# Altium schematic sheet 06 - Voltage Sense.SchDoc: Voltage Sense - 25kW WolfPACK FM3 Six-Pack Inv.
size 431 x 279 mm; Date: 01/2024; DocumentNumber: CRD25DA12N-FMC; Revision: 1.2; SheetNumber: 6; SheetTotal: 8; SheetSize: B
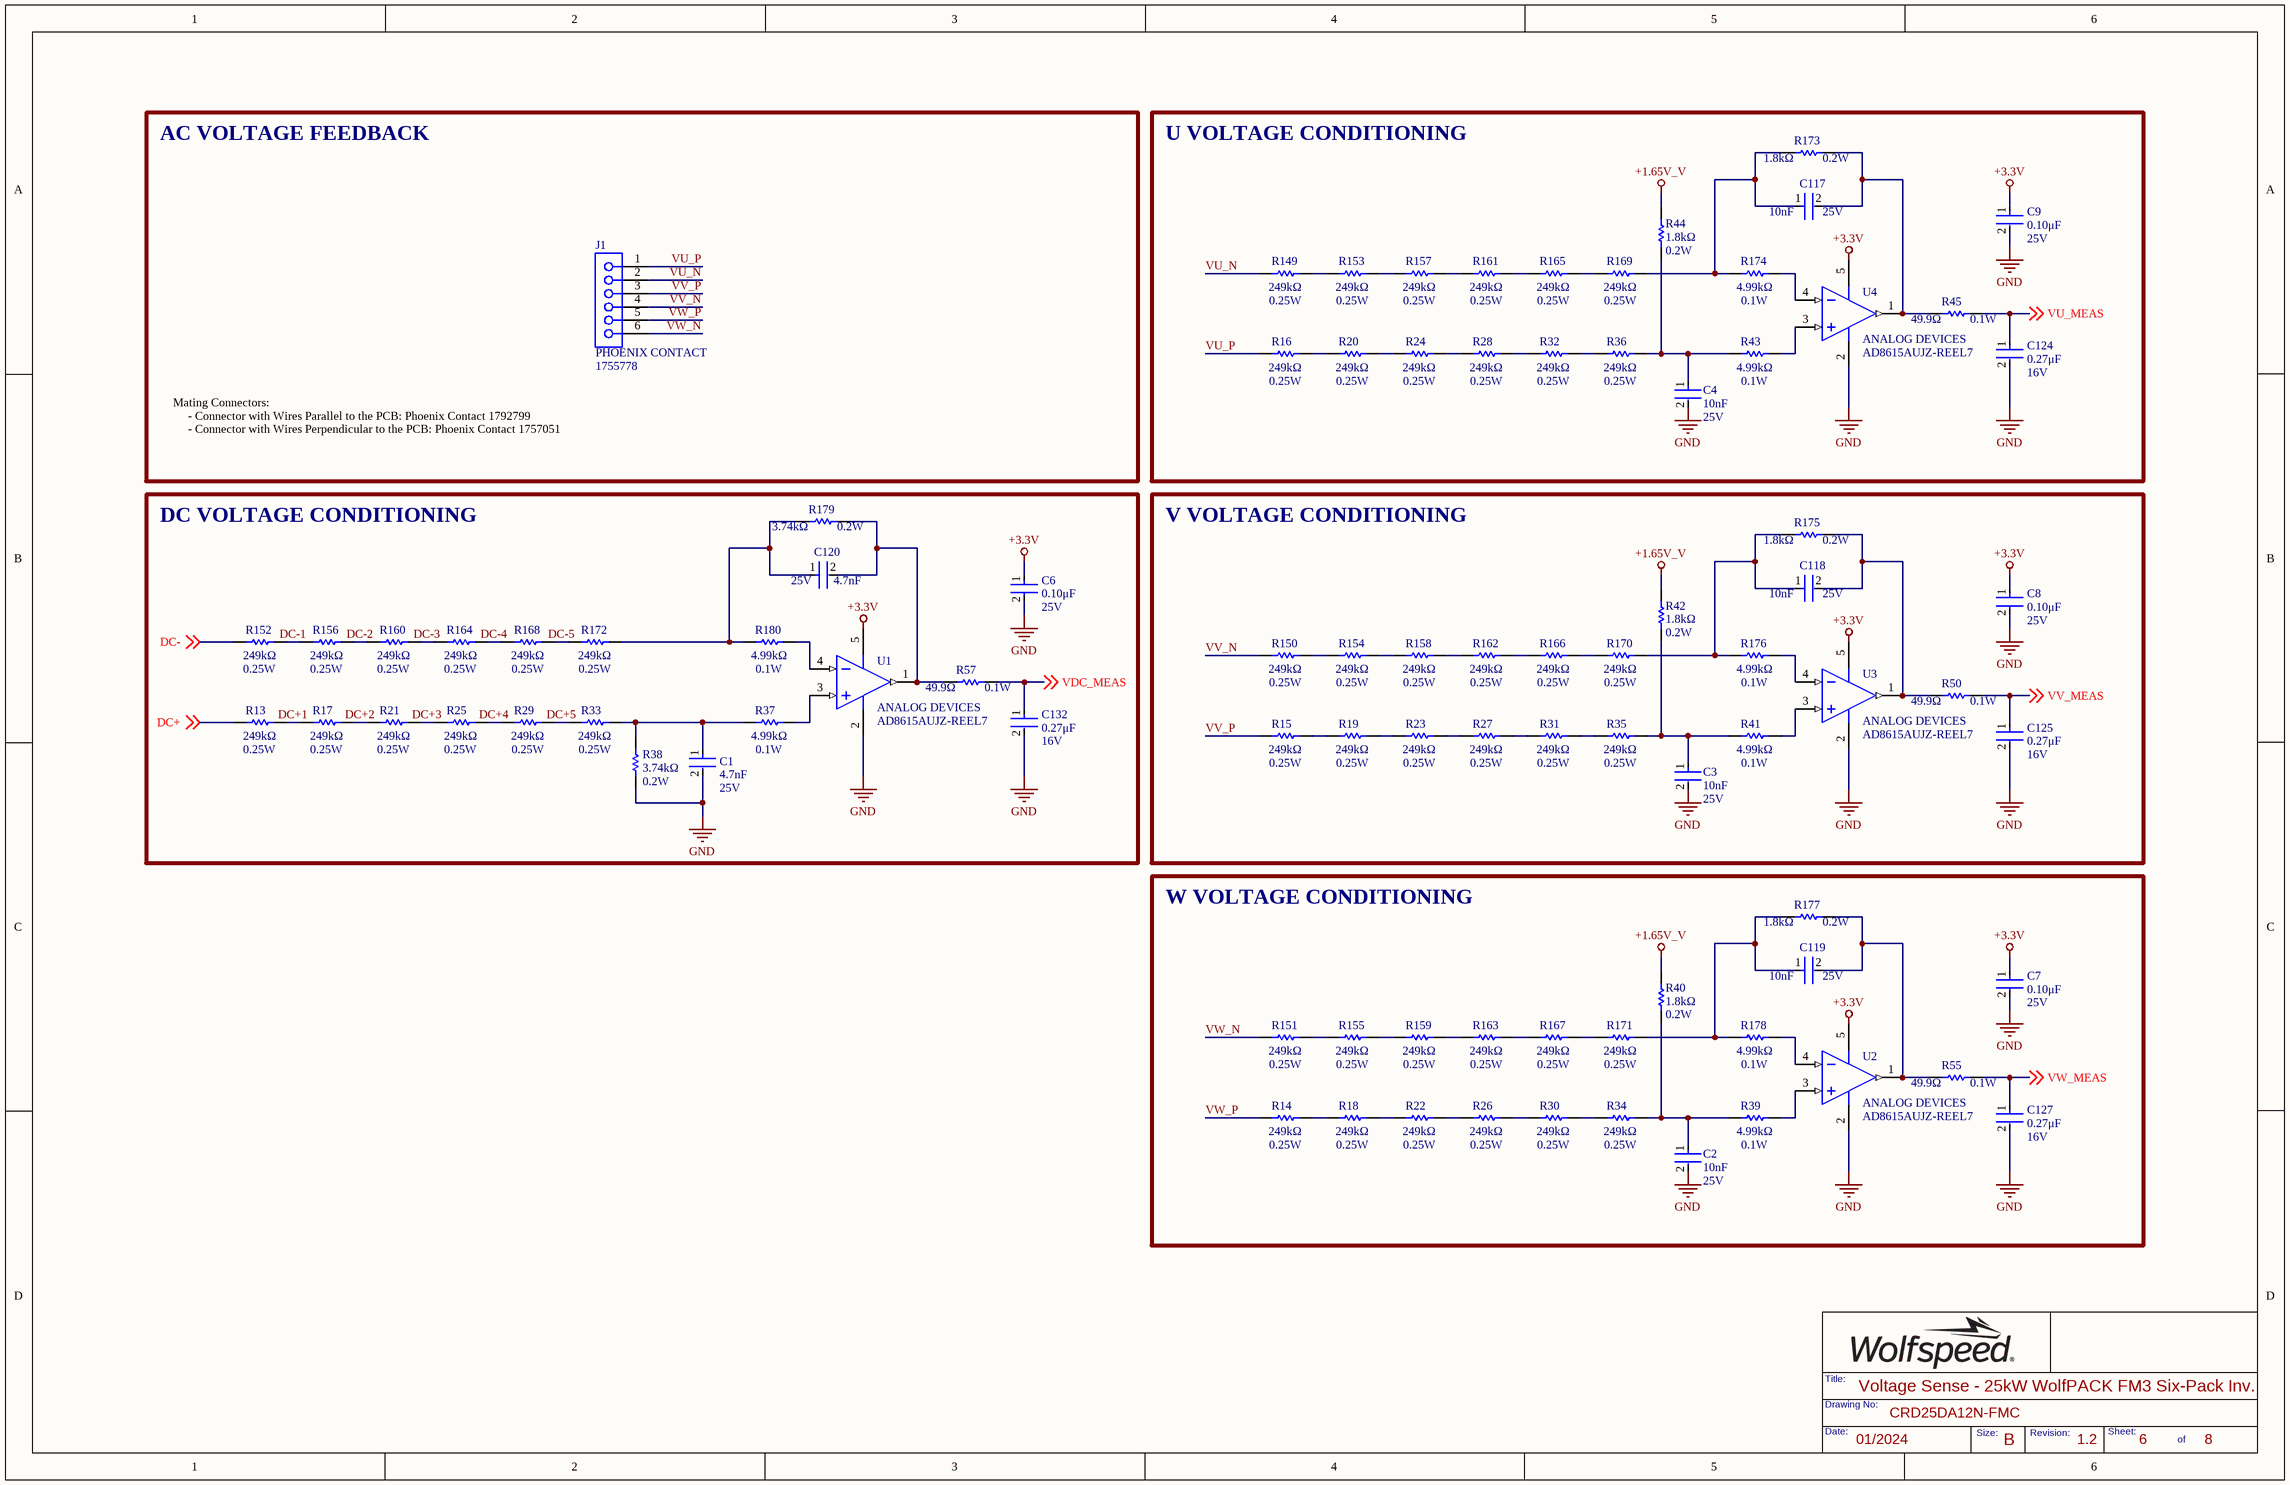
[diagram p0: 06 - Voltage Sense.SchDoc]

## Parts
C1  Voltage Rating: 25V  Capacitance: 4.7nF  [FP-C0603C-CF-IPC_B]  (hidden comment: C0603C472K3RAC7867)
C2  value 10nF  Voltage Rating: 25V  [FP-C0603C-CF-IPC_B]  (hidden comment: CL10B103KA8WPNC)
C3  value 10nF  Voltage Rating: 25V  [FP-C0603C-CF-IPC_B]  (hidden comment: CL10B103KA8WPNC)
C4  value 10nF  Voltage Rating: 25V  [FP-C0603C-CF-IPC_B]  (hidden comment: CL10B103KA8WPNC)
C6  Voltage Rating: 25V  Capacitance: 0.10μF  [FP-C0603C-CF-IPC_B]  (hidden comment: C0603C104K3RACTU)
C7  Voltage Rating: 25V  Capacitance: 0.10μF  [FP-C0603C-CF-IPC_B]  (hidden comment: C0603C104K3RACTU)
C8  Voltage Rating: 25V  Capacitance: 0.10μF  [FP-C0603C-CF-IPC_B]  (hidden comment: C0603C104K3RACTU)
C9  Voltage Rating: 25V  Capacitance: 0.10μF  [FP-C0603C-CF-IPC_B]  (hidden comment: C0603C104K3RACTU)
C117  value 10nF  Voltage Rating: 25V  [FP-C0603C-CF-IPC_B]  (hidden comment: CL10B103KA8WPNC)
C118  value 10nF  Voltage Rating: 25V  [FP-C0603C-CF-IPC_B]  (hidden comment: CL10B103KA8WPNC)
C119  value 10nF  Voltage Rating: 25V  [FP-C0603C-CF-IPC_B]  (hidden comment: CL10B103KA8WPNC)
C120  Voltage Rating: 25V  Capacitance: 4.7nF  [FP-C0603C-CF-IPC_B]  (hidden comment: C0603C472K3RAC7867)
C124  Voltage Rating (DC): 16V  Capacitance: 0.27μF  [FP-GCM188-0_1-IPC_A]  (hidden comment: GCM188R71C274KA37D)
C125  Voltage Rating (DC): 16V  Capacitance: 0.27μF  [FP-GCM188-0_1-IPC_A]  (hidden comment: GCM188R71C274KA37D)
C127  Voltage Rating (DC): 16V  Capacitance: 0.27μF  [FP-GCM188-0_1-IPC_A]  (hidden comment: GCM188R71C274KA37D)
C132  Voltage Rating (DC): 16V  Capacitance: 0.27μF  [FP-GCM188-0_1-IPC_A]  (hidden comment: GCM188R71C274KA37D)
J1  1755778  Manufacturer Print: PHOENIX CONTACT  [1755778]
R13  Resistance: 249kΩ  Power: 0.25W  [RESC3216X65X50NL15T25]  (hidden comment: TNPW1206249KBEEA)
R14  Resistance: 249kΩ  Power: 0.25W  [RESC3216X65X50NL15T25]  (hidden comment: TNPW1206249KBEEA)
R15  Resistance: 249kΩ  Power: 0.25W  [RESC3216X65X50NL15T25]  (hidden comment: TNPW1206249KBEEA)
R16  Resistance: 249kΩ  Power: 0.25W  [RESC3216X65X50NL15T25]  (hidden comment: TNPW1206249KBEEA)
R17  Resistance: 249kΩ  Power: 0.25W  [RESC3216X65X50NL15T25]  (hidden comment: TNPW1206249KBEEA)
R18  Resistance: 249kΩ  Power: 0.25W  [RESC3216X65X50NL15T25]  (hidden comment: TNPW1206249KBEEA)
R19  Resistance: 249kΩ  Power: 0.25W  [RESC3216X65X50NL15T25]  (hidden comment: TNPW1206249KBEEA)
R20  Resistance: 249kΩ  Power: 0.25W  [RESC3216X65X50NL15T25]  (hidden comment: TNPW1206249KBEEA)
R21  Resistance: 249kΩ  Power: 0.25W  [RESC3216X65X50NL15T25]  (hidden comment: TNPW1206249KBEEA)
R22  Resistance: 249kΩ  Power: 0.25W  [RESC3216X65X50NL15T25]  (hidden comment: TNPW1206249KBEEA)
R23  Resistance: 249kΩ  Power: 0.25W  [RESC3216X65X50NL15T25]  (hidden comment: TNPW1206249KBEEA)
R24  Resistance: 249kΩ  Power: 0.25W  [RESC3216X65X50NL15T25]  (hidden comment: TNPW1206249KBEEA)
R25  Resistance: 249kΩ  Power: 0.25W  [RESC3216X65X50NL15T25]  (hidden comment: TNPW1206249KBEEA)
R26  Resistance: 249kΩ  Power: 0.25W  [RESC3216X65X50NL15T25]  (hidden comment: TNPW1206249KBEEA)
R27  Resistance: 249kΩ  Power: 0.25W  [RESC3216X65X50NL15T25]  (hidden comment: TNPW1206249KBEEA)
R28  Resistance: 249kΩ  Power: 0.25W  [RESC3216X65X50NL15T25]  (hidden comment: TNPW1206249KBEEA)
R29  Resistance: 249kΩ  Power: 0.25W  [RESC3216X65X50NL15T25]  (hidden comment: TNPW1206249KBEEA)
R30  Resistance: 249kΩ  Power: 0.25W  [RESC3216X65X50NL15T25]  (hidden comment: TNPW1206249KBEEA)
R31  Resistance: 249kΩ  Power: 0.25W  [RESC3216X65X50NL15T25]  (hidden comment: TNPW1206249KBEEA)
R32  Resistance: 249kΩ  Power: 0.25W  [RESC3216X65X50NL15T25]  (hidden comment: TNPW1206249KBEEA)
R33  Resistance: 249kΩ  Power: 0.25W  [RESC3216X65X50NL15T25]  (hidden comment: TNPW1206249KBEEA)
R34  Resistance: 249kΩ  Power: 0.25W  [RESC3216X65X50NL15T25]  (hidden comment: TNPW1206249KBEEA)
R35  Resistance: 249kΩ  Power: 0.25W  [RESC3216X65X50NL15T25]  (hidden comment: TNPW1206249KBEEA)
R36  Resistance: 249kΩ  Power: 0.25W  [RESC3216X65X50NL15T25]  (hidden comment: TNPW1206249KBEEA)
R37  Power Rating: 0.1W  Resistance: 4.99kΩ  [FP-MCR03-IPC_B]  (hidden comment: RC0603FR-074K99L)
R38  Max Power Dissipation: 0.2W  Resistance: 3.74kΩ  [FP-MCR03-IPC_B]  (hidden comment: ERJ-PB3B3741V)
R39  Power Rating: 0.1W  Resistance: 4.99kΩ  [FP-MCR03-IPC_B]  (hidden comment: RC0603FR-074K99L)
R40  Resistance: 1.8kΩ  Max Power Dissipation: 0.2W  [FP-MCR03-IPC_B]  (hidden comment: ERJ-PB3B1801V)
R41  Power Rating: 0.1W  Resistance: 4.99kΩ  [FP-MCR03-IPC_B]  (hidden comment: RC0603FR-074K99L)
R42  Resistance: 1.8kΩ  Max Power Dissipation: 0.2W  [FP-MCR03-IPC_B]  (hidden comment: ERJ-PB3B1801V)
R43  Power Rating: 0.1W  Resistance: 4.99kΩ  [FP-MCR03-IPC_B]  (hidden comment: RC0603FR-074K99L)
R44  Resistance: 1.8kΩ  Max Power Dissipation: 0.2W  [FP-MCR03-IPC_B]  (hidden comment: ERJ-PB3B1801V)
R45  Resistance: 49.9Ω  Power Rating: 0.1W  [FP-MCR03-IPC_B]  (hidden comment: ERJ-3EKF49R9V)
R50  Resistance: 49.9Ω  Power Rating: 0.1W  [FP-MCR03-IPC_B]  (hidden comment: ERJ-3EKF49R9V)
R55  Resistance: 49.9Ω  Power Rating: 0.1W  [FP-MCR03-IPC_B]  (hidden comment: ERJ-3EKF49R9V)
R57  Resistance: 49.9Ω  Power Rating: 0.1W  [FP-MCR03-IPC_B]  (hidden comment: ERJ-3EKF49R9V)
R149  Resistance: 249kΩ  Power: 0.25W  [RESC3216X65X50NL15T25]  (hidden comment: TNPW1206249KBEEA)
R150  Resistance: 249kΩ  Power: 0.25W  [RESC3216X65X50NL15T25]  (hidden comment: TNPW1206249KBEEA)
R151  Resistance: 249kΩ  Power: 0.25W  [RESC3216X65X50NL15T25]  (hidden comment: TNPW1206249KBEEA)
R152  Resistance: 249kΩ  Power: 0.25W  [RESC3216X65X50NL15T25]  (hidden comment: TNPW1206249KBEEA)
R153  Resistance: 249kΩ  Power: 0.25W  [RESC3216X65X50NL15T25]  (hidden comment: TNPW1206249KBEEA)
R154  Resistance: 249kΩ  Power: 0.25W  [RESC3216X65X50NL15T25]  (hidden comment: TNPW1206249KBEEA)
R155  Resistance: 249kΩ  Power: 0.25W  [RESC3216X65X50NL15T25]  (hidden comment: TNPW1206249KBEEA)
R156  Resistance: 249kΩ  Power: 0.25W  [RESC3216X65X50NL15T25]  (hidden comment: TNPW1206249KBEEA)
R157  Resistance: 249kΩ  Power: 0.25W  [RESC3216X65X50NL15T25]  (hidden comment: TNPW1206249KBEEA)
R158  Resistance: 249kΩ  Power: 0.25W  [RESC3216X65X50NL15T25]  (hidden comment: TNPW1206249KBEEA)
R159  Resistance: 249kΩ  Power: 0.25W  [RESC3216X65X50NL15T25]  (hidden comment: TNPW1206249KBEEA)
R160  Resistance: 249kΩ  Power: 0.25W  [RESC3216X65X50NL15T25]  (hidden comment: TNPW1206249KBEEA)
R161  Resistance: 249kΩ  Power: 0.25W  [RESC3216X65X50NL15T25]  (hidden comment: TNPW1206249KBEEA)
R162  Resistance: 249kΩ  Power: 0.25W  [RESC3216X65X50NL15T25]  (hidden comment: TNPW1206249KBEEA)
R163  Resistance: 249kΩ  Power: 0.25W  [RESC3216X65X50NL15T25]  (hidden comment: TNPW1206249KBEEA)
R164  Resistance: 249kΩ  Power: 0.25W  [RESC3216X65X50NL15T25]  (hidden comment: TNPW1206249KBEEA)
R165  Resistance: 249kΩ  Power: 0.25W  [RESC3216X65X50NL15T25]  (hidden comment: TNPW1206249KBEEA)
R166  Resistance: 249kΩ  Power: 0.25W  [RESC3216X65X50NL15T25]  (hidden comment: TNPW1206249KBEEA)
R167  Resistance: 249kΩ  Power: 0.25W  [RESC3216X65X50NL15T25]  (hidden comment: TNPW1206249KBEEA)
R168  Resistance: 249kΩ  Power: 0.25W  [RESC3216X65X50NL15T25]  (hidden comment: TNPW1206249KBEEA)
R169  Resistance: 249kΩ  Power: 0.25W  [RESC3216X65X50NL15T25]  (hidden comment: TNPW1206249KBEEA)
R170  Resistance: 249kΩ  Power: 0.25W  [RESC3216X65X50NL15T25]  (hidden comment: TNPW1206249KBEEA)
R171  Resistance: 249kΩ  Power: 0.25W  [RESC3216X65X50NL15T25]  (hidden comment: TNPW1206249KBEEA)
R172  Resistance: 249kΩ  Power: 0.25W  [RESC3216X65X50NL15T25]  (hidden comment: TNPW1206249KBEEA)
R173  Resistance: 1.8kΩ  Max Power Dissipation: 0.2W  [FP-MCR03-IPC_B]  (hidden comment: ERJ-PB3B1801V)
R174  Power Rating: 0.1W  Resistance: 4.99kΩ  [FP-MCR03-IPC_B]  (hidden comment: RC0603FR-074K99L)
R175  Resistance: 1.8kΩ  Max Power Dissipation: 0.2W  [FP-MCR03-IPC_B]  (hidden comment: ERJ-PB3B1801V)
R176  Power Rating: 0.1W  Resistance: 4.99kΩ  [FP-MCR03-IPC_B]  (hidden comment: RC0603FR-074K99L)
R177  Resistance: 1.8kΩ  Max Power Dissipation: 0.2W  [FP-MCR03-IPC_B]  (hidden comment: ERJ-PB3B1801V)
R178  Power Rating: 0.1W  Resistance: 4.99kΩ  [FP-MCR03-IPC_B]  (hidden comment: RC0603FR-074K99L)
R179  Max Power Dissipation: 0.2W  Resistance: 3.74kΩ  [FP-MCR03-IPC_B]  (hidden comment: ERJ-PB3B3741V)
R180  Power Rating: 0.1W  Resistance: 4.99kΩ  [FP-MCR03-IPC_B]  (hidden comment: RC0603FR-074K99L)
U1  Manufacturer: ANALOG DEVICES  [ADI-UJ-5_M]  (hidden comment: AD8615AUJZ-REEL7)
U2  Manufacturer: ANALOG DEVICES  [ADI-UJ-5_M]  (hidden comment: AD8615AUJZ-REEL7)
U3  Manufacturer: ANALOG DEVICES  [ADI-UJ-5_M]  (hidden comment: AD8615AUJZ-REEL7)
U4  Manufacturer: ANALOG DEVICES  [ADI-UJ-5_M]  (hidden comment: AD8615AUJZ-REEL7)

## Blocks framed on the sheet
AC VOLTAGE FEEDBACK: J1
U VOLTAGE CONDITIONING: C4 C9 C117 C124 R16 R20 R24 R28 R32 R36 R43-R45 R149 R153 R157 R161 R165 R169 R173 R174 U4
DC VOLTAGE CONDITIONING: C1 C6 C120 C132 R13 R17 R21 R25 R29 R33 R37 R38 R57 R152 R156 R160 R164 R168 R172 R179 R180 U1
V VOLTAGE CONDITIONING: C3 C8 C118 C125 R15 R19 R23 R27 R31 R35 R41 R42 R50 R150 R154 R158 R162 R166 R170 R175 R176 U3
W VOLTAGE CONDITIONING: C2 C7 C119 C127 R14 R18 R22 R26 R30 R34 R39 R40 R55 R151 R155 R159 R163 R167 R171 R177 R178 U2

## Nets
+1.65V_V: R40.2 R42.2 R44.2
+3.3V: C6.1 C7.1 C8.1 C9.1 U1.5(+V) U2.5(+V) U3.5(+V) U4.5(+V)
GND: C1.2 C2.2 C3.2 C4.2 C6.2 C7.2 C8.2 C9.2 C124.2 C125.2 C127.2 C132.2 R38.1 U1.2(-V) U2.2(-V) U3.2(-V) U4.2(-V)
DC+: R13.1 ; off-sheet DC+
DC+1: R13.2 R17.1
DC+2: R17.2 R21.1
DC+3: R21.2 R25.1
DC+4: R25.2 R29.1
DC+5: R29.2 R33.1
DC-: R152.1 ; off-sheet DC-
DC-1: R152.2 R156.1
DC-2: R156.2 R160.1
DC-3: R160.2 R164.1
DC-4: R164.2 R168.1
DC-5: R168.2 R172.1
VDC_MEAS: C132.1 R57.2 ; off-sheet VDC_MEAS
VU_MEAS: C124.1 R45.2 ; off-sheet VU_MEAS
VU_N: J1.2 R149.1
VU_P: J1.1 R16.1
VV_MEAS: C125.1 R50.2 ; off-sheet VV_MEAS
VV_N: J1.4 R150.1
VV_P: J1.3 R15.1
VW_MEAS: C127.1 R55.2 ; off-sheet VW_MEAS
VW_N: J1.6 R151.1
VW_P: J1.5 R14.1
NetC1_1: C1.1 R33.2 R37.1 R38.2
NetC2_1: C2.1 R34.2 R39.1 R40.1
NetC3_1: C3.1 R35.2 R41.1 R42.1
NetC4_1: C4.1 R36.2 R43.1 R44.1
NetC117_1: C117.1 R169.2 R173.2 R174.1
NetC117_2: C117.2 R45.1 R173.1 U4.1(OUT)
NetC118_1: C118.1 R170.2 R175.2 R176.1
NetC118_2: C118.2 R50.1 R175.1 U3.1(OUT)
NetC119_1: C119.1 R171.2 R177.2 R178.1
NetC119_2: C119.2 R55.1 R177.1 U2.1(OUT)
NetC120_1: C120.1 R172.2 R179.1 R180.1
NetC120_2: C120.2 R57.1 R179.2 U1.1(OUT)
NetR14_2: R14.2 R18.1
NetR15_2: R15.2 R19.1
NetR16_2: R16.2 R20.1
NetR18_2: R18.2 R22.1
NetR19_2: R19.2 R23.1
NetR20_2: R20.2 R24.1
NetR22_2: R22.2 R26.1
NetR23_2: R23.2 R27.1
NetR24_2: R24.2 R28.1
NetR26_2: R26.2 R30.1
NetR27_2: R27.2 R31.1
NetR28_2: R28.2 R32.1
NetR30_2: R30.2 R34.1
NetR31_2: R31.2 R35.1
NetR32_2: R32.2 R36.1
NetR37_2: R37.2 U1.3(+IN)
NetR39_2: R39.2 U2.3(+IN)
NetR41_2: R41.2 U3.3(+IN)
NetR43_2: R43.2 U4.3(+IN)
NetR149_2: R149.2 R153.1
NetR150_2: R150.2 R154.1
NetR151_2: R151.2 R155.1
NetR153_2: R153.2 R157.1
NetR154_2: R154.2 R158.1
NetR155_2: R155.2 R159.1
NetR157_2: R157.2 R161.1
NetR158_2: R158.2 R162.1
NetR159_2: R159.2 R163.1
NetR161_2: R161.2 R165.1
NetR162_2: R162.2 R166.1
NetR163_2: R163.2 R167.1
NetR165_2: R165.2 R169.1
NetR166_2: R166.2 R170.1
NetR167_2: R167.2 R171.1
NetR174_2: R174.2 U4.4(-IN)
NetR176_2: R176.2 U3.4(-IN)
NetR178_2: R178.2 U2.4(-IN)
NetR180_2: R180.2 U1.4(-IN)

## Notes on the sheet
- Mating Connectors:
  - Connector with Wires Parallel to the PCB: Phoenix Contact 1792799
  - Connector with Wires Perpendicular to the PCB: Phoenix Contact 1757051
- Title:
- Date:
- Drawing No:
- Size:
- Revision:
- Sheet:
- of

## Library data of the parts
C1 C120 = C0603C472K3RAC7867: CAP CER 4700PF 25V 10% X7R 0603; Manufacturer: KEMET; Manufacturer Part Number: C0603C472K3RACTU; Dielectric Material: Ceramic; Value: 4.7nF; Supplier 1: Newark; RoHS: Yes; Category: Ceramic Capacitors; Stock 1: 8000; Pricing 1: 1=0.04800, 4000=0.04800 (USD); Mount: Surface Mount; Package: 0603; Case Code (Metric): 1608; Case Code (Imperial): 0603; Min Operating Temperature: -55°C; Max Operating Temperature: 125°C; Tolerance: 10%; Dielectric: X7R; Packaging: Tape and Reel; Package Quantity: 1; Voltage Rating (DC): 25V; Termination: SMD/SMT; Dissipation Factor: 10%; Series: C; Construction: Flat; Length: 1.6mm; Width: 0.031inch; Height: 0.8mm; Thickness: 0.034inch; Lead Pitch: 0.7mm; Depth: 0.8mm; Radiation Hardening: No; Reach SVHC Compliant: Yes; RoHS Compliant: Yes; ComponentLink1URL: https://datasheet.ciiva.com/5414/kem-c1002-x7r-smd-357932-5414293.pdf?src-supplier=Mouser; ComponentLink1Description: https://datasheet.ciiva.com/5414/kem-c1002-x7r-smd-357932-5414293.pdf?src-supplier=Mouser; Supplier Part Number 1: 67AH9250
C2-C4 C117-C119 = CL10B103KA8WPNC: CAP CER 10000PF 25V X7R 0603; Manufacturer: SAMSUNG; Tolerance: 10%; Supplier 1: Arrow Electronics; Manufacturer Part Number: CL10B103KA8WPNC; RoHS: Yes; Category: Ceramic Capacitors; Stock 1: 144000; Pricing 1: 4000=0.00760, 8000=0.00670, 28000=0.00660, 100000=0.00500 (USD); Mount: Surface Mount; Package: 0603; Case Code (Metric): 1608; Case Code (Imperial): 0603; Min Operating Temperature: -55°C; Max Operating Temperature: 125°C; Packaging: Tape and Reel; Capacitance: 10nF; Features: Soft Termination; Length: 0.063inch; Width: 0.031inch; Thickness: 0.035inch; Ratings: AEC-Q200; RoHS Compliant: Yes; ComponentLink1URL: http://www.samsungsem.com/kr/support/product-search/mlcc/CL10B103KA8WPNC.jsp?src-supplier=Digi-Key; ComponentLink1Description: http://www.samsungsem.com/kr/support/product-search/mlcc/CL10B103KA8WPNC.jsp?src-supplier=Digi-Key; ComponentLink2URL: http://www.samsungsem.com/kr/support/library/product-catalog/mlcc.jsp?src-supplier=Digi-Key; ComponentLink2Description: http://www.samsungsem.com/kr/support/library/product-catalog/mlcc.jsp?src-supplier=Digi-Key; ComponentLink3URL: http://www.samsungsem.com/servlet/FileDownload?filename=productcatalog/pdf/MLCC.pdf&src-supplier=Avnet; ComponentLink3Description: http://www.samsungsem.com/servlet/FileDownload?filename=productcatalog/pdf/MLCC.pdf&src-supplier=Avnet; Supplier Part Number 1: CL10B103KA8WPNC
C6-C9 = CMP-2006-03057-2: CAP CER 0.1UF 25V X7R 0603; Manufacturer: KEMET; Value: 0.10μF; Material: Ceramic; Tolerance: 0.1; Temperature Coefficient: 30ppm/°C; Automotive Grade: Grade 1; Lead Free: Yes; Device Class L3: Ceramic Capacitors; Manufacturer Part Number: C0603C104K3RACTU; Digikey Description: CAP CER 0.1UF 25V X7R 0603; Mouser Description: Multilayer Ceramic Capacitors MLCC - SMD/SMT 25volts 0.1uF X7R 10%; Package: 0603; Temperature Range Low: -55°C; Automotive: Yes; Device Class L2: Capacitors; Octopart: https://octopart.com/c0603c104k3ractu-kemet-127541; ComponentLink2Description: Datasheet; ComponentLink2URL: https://api.kemet.com/component-edge/download/datasheet/C0603C100J5GACAUTO.pdf; Temperature Range High: +125°C; RoHS: TRUE; Device Class L1: Passive Components; Category: Cap; Temperature: -55°C to +125°C; Height: 0.87mm; Temperature Characteristic: X7R
C124 C125 C127 C132 = CMP-06035-043171-1: CAP CER 0.27UF 16V X7R 0603; Manufacturer: MURATA; Tolerance: 10%; Value: 0.27μF; Dielectric: X7R; Package: 0603; Manufacturer Part Number: GCM188R71C274KA37D
J1 = 1755778: TERM BLOCK HDR 6POS VERT 5.08MM; Voltage Rating: 250V; Current Rating: 12A; Number of Positions: 6; Number of Levels: 1; Voltage: 300V; Gender: Male; Connector Type: Plug; Approvals: UL,CSA,VDE,cULus,CB,EAC; Supplier 1: Rs; Manufacturer: PHOENIX CONTACT; Manufacturer Part Number: 1755778; RoHS: Yes; Category: Terminal Blocks; Stock 1: 400; Mount: Through Hole; Contact Plating: Tin; Color: Green,Grey; Housing Color: Green; Housing Material: Polybutylene; Weight: 5.467464oz; Contact Material: Tin; Package Quantity: 50; Packaging: Bulk; Termination: Solder; Series: MSTBVA; Max Current Rating: 12A; Number of Positions Per Level: 6; Current: 12A; Number of Contacts: 6; Orientation: Straight; Voltage Rating (DC): 250V; Number of Rows: 1; Number of Poles: 6; Length: 32.48mm; Width: 32.48mm; Height: 15.9mm; Pitch: 5.08mm; Depth: 8.6mm; Lead Free: Lead Free; Flammability Rating: UL94 V-0; RoHS Compliant: Yes; ComponentLink1URL: https://datasheet.ciiva.com/16096/1755778-16096327.pdf?src-supplier=Onlinecomponents.com; ComponentLink1Description: https://datasheet.ciiva.com/16096/1755778-16096327.pdf?src-supplier=Onlinecomponents.com; ComponentLink2URL: https://datasheet.ciiva.com/15197/getdatasheetpartid-176346-15197318.pdf?src-supplier=Verical; ComponentLink2Description: https://datasheet.ciiva.com/15197/getdatasheetpartid-176346-15197318.pdf?src-supplier=Verical; ComponentLink3URL: https://datasheet.ciiva.com/796/1755778-796714.pdf?src-supplier=Digi-Key; ComponentLink3Description: https://datasheet.ciiva.com/796/1755778-796714.pdf?src-supplier=Digi-Key; ComponentLink4URL: https://datasheet.ciiva.com/29209/568561-da-01-en-grundgehaeuse-1755778-100-st-29209867.pdf?src-supplier=Conrad; ComponentLink4Description: https://datasheet.ciiva.com/29209/568561-da-01-en-grundgehaeuse-1755778-100-st-29209867.pdf?src-supplier=Conrad; ComponentLink5URL: https://datasheet.ciiva.com/18409/70054655-18409468.pdf?src-supplier=Allied+Electronics; ComponentLink5Description: https://datasheet.ciiva.com/18409/70054655-18409468.pdf?src-supplier=Allied+Electronics; Supplier Part Number 1: 1896240; Value: N/A; Package: N/A
R13-R36 R149-R172 = CMP-2003-04604-1: RES 249K OHM 0.1% 1/4W 1206; Manufacturer: VISHAY DALE; Value: 249kΩ; Manufacturer Part Number: TNPW1206249KBEEA; Package: 1206
R37 R39 R41 R43 R174 R176 R178 R180 = RC0603FR-074K99L: RES 4.99K OHM 1% 1/10W 0603; Manufacturer: YAGEO; Voltage Rating: 75V; Temperature Coefficient: 100ppm/°C; Voltage Rating (DC): 50V; Value: 4.99kΩ; Supplier 1: Rs; Manufacturer Part Number: RC0603FR-074K99L; RoHS: Yes; Category: Chip SMD Resistors; Stock 1: 3700; Package: 0603; Number of Pins: 2; Case Code (Imperial): 0603; Case Code (Metric): 1608; Weight: 7.1E-05oz; Size Code: 0603; Min Operating Temperature: -55°C; Max Operating Temperature: 155°C; Packaging: Tape and Reel; Tolerance: 1%; Package Quantity: 1; Termination: SMD/SMT; Resistor Type: Thick Film; Number of Terminations: 2; Max Power Dissipation: 0.1W; Features: Moisture Resistant; Series: RC; Construction: Rectangular; Resistance Tolerance: 1%; Length: 1.6mm; Width: 0.8mm; Height: 0.45mm; Depth: 0.8mm; Military Standard: Not; Lead Free: Lead Free; RoHS Compliant: Yes; ComponentLink1URL: https://datasheet.ciiva.com/7983/443971-7983646.pdf?src-supplier=Element14; ComponentLink1Description: https://datasheet.ciiva.com/7983/443971-7983646.pdf?src-supplier=Element14; ComponentLink2URL: https://datasheet.ciiva.com/22747/443971-22747529.pdf?src-supplier=Element14; ComponentLink2Description: https://datasheet.ciiva.com/22747/443971-22747529.pdf?src-supplier=Element14; ComponentLink3URL: https://datasheet.ciiva.com/2453/pyu-r-int-thick-7-2453980.pdf?src-supplier=Digi-Key; ComponentLink3Description: https://datasheet.ciiva.com/2453/pyu-r-int-thick-7-2453980.pdf?src-supplier=Digi-Key; ComponentLink4URL: https://datasheet.ciiva.com/2453/pyu-r-int-thick-7-2453981.pdf?src-supplier=Digi-Key; ComponentLink4Description: https://datasheet.ciiva.com/2453/pyu-r-int-thick-7-2453981.pdf?src-supplier=Digi-Key; ComponentLink5URL: https://datasheet.ciiva.com/2453/pyu-r-int-thick-7-2453979.pdf?src-supplier=Digi-Key; ComponentLink5Description: https://datasheet.ciiva.com/2453/pyu-r-int-thick-7-2453979.pdf?src-supplier=Digi-Key; Supplier Part Number 1: 1995595
R38 R179 = ERJ-PB3B3741V: RES SMD 3.74K OHM 0.1% 1/5W 0603; Manufacturer: PANASONIC; Temperature Coefficient: 50ppm/°C; Value: 3.74kΩ; Supplier 1: Arrow Electronics; Manufacturer Part Number: ERJ-PB3B3741V; RoHS: Yes; Category: Chip SMD Resistors; Stock 1: 1328; Pricing 1: 1=0.04530, 10=0.01990, 100=0.01980 (USD); Package: 0603; Case Code (Metric): 1608; Case Code (Imperial): 0603; Min Operating Temperature: -55°C; Max Operating Temperature: 155°C; Packaging: Tape and Reel; Resistor Type: Thick Film; Number of Terminations: 2; Tolerance: 0.1%; Features: Automotive AEC-Q200; Length: 0.063inch; Width: 0.032inch; Height - Seated (Max): 0.022inch; ComponentLink1URL: https://industrial.panasonic.com/sa/system/files/data/download/catalog/id_fixed-resistors_e_2.pdf?src-supplier=Digi-Key; ComponentLink1Description: https://industrial.panasonic.com/sa/system/files/data/download/catalog/id_fixed-resistors_e_2.pdf?src-supplier=Digi-Key; Supplier Part Number 1: ERJ-PB3B3741V
R40 R42 R44 R173 R175 R177 = ERJ-PB3B1801V: RES SMD 1.8K OHM 0.1% 1/5W 0603; Manufacturer: PANASONIC; Temperature Coefficient: 50ppm/°C; Value: 1.8kΩ; Supplier 1: Arrow Electronics; Manufacturer Part Number: ERJ-PB3B1801V; RoHS: Yes; Category: Chip SMD Resistors; Stock 1: 7475; Pricing 1: 1=0.24860, 10=0.21250, 25=0.15580, 100=0.08750, 250=0.07800, 500=0.04680, 1000=0.02760, 3000=0.02730, 6000=0.02700 (USD); Package: 0603; Case Code (Metric): 1608; Case Code (Imperial): 0603; Min Operating Temperature: -55°C; Max Operating Temperature: 155°C; Packaging: Tape and Reel; Resistor Type: Thick Film; Number of Terminations: 2; Tolerance: 0.1%; Features: Automotive AEC-Q200; Length: 0.063inch; Width: 0.032inch; Height - Seated (Max): 0.022inch; ComponentLink1URL: https://industrial.panasonic.com/sa/system/files/data/download/catalog/id_fixed-resistors_e_2.pdf?src-supplier=Digi-Key; ComponentLink1Description: https://industrial.panasonic.com/sa/system/files/data/download/catalog/id_fixed-resistors_e_2.pdf?src-supplier=Digi-Key; Supplier Part Number 1: ERJ-PB3B1801V
R45 R50 R55 R57 = ERJ-3EKF49R9V: RES SMD 49.9 OHM 1% 1/10W 0603; Manufacturer: PANASONIC; Temperature Coefficient: 100ppm/°C; Voltage Rating: 75V; Max Power Dissipation: 100mW; Voltage Rating (DC): 50V; Working Voltage: 6V; Value: 49.9Ω; Supplier 1: Newark; Manufacturer Part Number: ERJ-3EKF49R9V; RoHS: Yes; Category: Chip SMD Resistors; Stock 1: 670000; Pricing 1: 1=0.00600, 5000=0.00600 (USD); Mount: Surface Mount; Package: 0603; Contact Plating: Tin; Case Code (Imperial): 0603; Case Code (Metric): 1608; Min Operating Temperature: -55°C; Max Operating Temperature: 155°C; Tolerance: 1%; Resistor Type: Thick Film; Packaging: Tape and Reel; Package Quantity: 5000; Number of Terminations: 2; Termination: SMD/SMT; Features: Automotive AEC-Q200; Series: ERJ; Resistance Tolerance: 1%; Construction: Rectangular; Technology: THICK FILM; Length: 1.6mm; Width: 0.8mm; Height: 0.022inch; Depth: 0.8mm; Radiation Hardening: No; Reach SVHC Compliant: Yes; Military Standard: Not; Lead Free: Lead Free; RoHS Compliant: Yes; ComponentLink1URL: https://datasheet.ciiva.com/46388/1678782-46388908.pdf?src-supplier=Element14; ComponentLink1Description: https://datasheet.ciiva.com/46388/1678782-46388908.pdf?src-supplier=Element14; ComponentLink2URL: https://datasheet.ciiva.com/28694/1678782-28694219.pdf?src-supplier=Element14; ComponentLink2Description: https://datasheet.ciiva.com/28694/1678782-28694219.pdf?src-supplier=Element14; ComponentLink3URL: https://datasheet.ciiva.com/16772/70260748-16772570.pdf?src-supplier=Allied+Electronics; ComponentLink3Description: https://datasheet.ciiva.com/16772/70260748-16772570.pdf?src-supplier=Allied+Electronics; ComponentLink4URL: https://datasheet.ciiva.com/16766/70260748-16766262.pdf?src-supplier=Allied+Electronics; ComponentLink4Description: https://datasheet.ciiva.com/16766/70260748-16766262.pdf?src-supplier=Allied+Electronics; ComponentLink5URL: https://datasheet.ciiva.com/9117/aoa0000ce2-9117128.pdf?src-supplier=Avnet; ComponentLink5Description: https://datasheet.ciiva.com/9117/aoa0000ce2-9117128.pdf?src-supplier=Avnet; ComponentLink6URL: https://datasheet.ciiva.com/48531/aoa0000ce2-48531019.pdf?src-supplier=Avnet; ComponentLink6Description: https://datasheet.ciiva.com/48531/aoa0000ce2-48531019.pdf?src-supplier=Avnet; ComponentLink7URL: https://datasheet.ciiva.com/30095/aoa0000ce2-30095355.pdf?src-supplier=Onlinecomponents.com; ComponentLink7Description: https://datasheet.ciiva.com/30095/aoa0000ce2-30095355.pdf?src-supplier=Onlinecomponents.com; Supplier Part Number 1: 12AC1058
U1-U4 = CMP-0384-02059-2: IC OPAMP GP 1 CIRCUIT TSOT23-5; Generic Part Number: AD8615; Iq/Amp: 1.7mA; V Span Max: 6V; Amplifiers Per Package: 1; Small Signal Bandwidth: 23MHz; Input Offset Voltage: 80uV; V Span Min: 2.7V; Slew Rate: 12V/us; Input Bias Current: 200fA; ComponentLink4URL: http://www.analog.com/en/all-operational-amplifiers-op-amps/operational-amplifiers-op-amps/ad8615/products/product.html#product-recommendations; DatasheetVersion: Rev. E; Code_JEDEC: MO-193-AB; ComponentLink3Description: Package Specification; PackageDescription: 5-Pin Thin Small Outline Transistor Package, Body 2.9 x 1.6 mm, Pitch 0.95 mm; ComponentLink4Description: Reference Circuit; RevisionNote: Reference Circuit URL fixed; ComponentLink1Description: Manufacturer URL; PartNumber: AD8615AUJZ-REEL7; Mounting Technology: Surface Mount; ComponentLink3URL: http:/www.analog.com/static/imported-files/packages/PKG_PDF/TSOT(UJ)/UJ_5.pdf; ComponentLink2URL: http://www.analog.com/static/imported-files/data_sheets/AD8615_8616_8618.pdf; PackageVersion: 100708-A; ComponentLink1URL: http://www.analog.com/en/index.html; ComponentLink2Description: Datasheet; PackageReference: UJ-5; Manufacturer Part Number: AD8615AUJZ-REEL7; Package: TSOT-23-5; Value: N/A